# EAGLE design IFX_breakout_04_eagle7 (EAGLE 7.7.0)
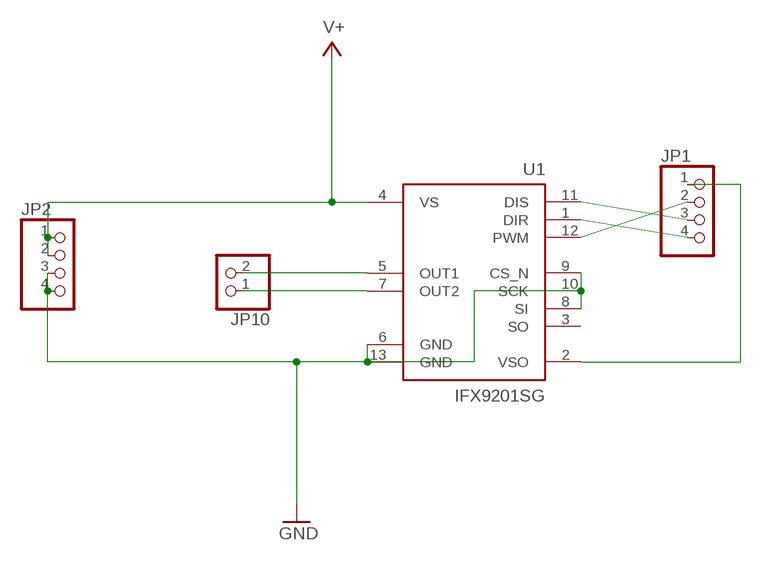
[diagram p0: schematic, sheet 1]

## Parts
JP1  PINHD-1X4  [1X04]
JP2  PINHD-1X4  [1X04]
JP10  PINHD-1X2/90  [1X02/90]
U1  IFX9201SG  [SOP100P1030X260-13N]

## Nets
!ENA: JP1.3 U1.11(DIS)
DIR: JP1.4 U1.1(DIR)
GND: JP2.3 JP2.4 U1.6(GND) U1.8(SI) U1.9(CS_N) U1.10(SCK) U1.13(GND)
N$9: JP10.2 U1.5(OUT1)
N$40: JP10.1 U1.7(OUT2)
PWM: JP1.2 U1.12(PWM)
V3.3: JP1.1 U1.2(VSO)
V+: JP2.1 JP2.2 U1.4(VS)
Unconnected: U1.3(SO)

## Library data of the parts
JP1 JP2 = pinhead:PINHD-1X4: PIN HEADER
JP10 = pinhead:PINHD-1X2: PIN HEADER
U1 = IFX9201SG:IFX9201SG: IFX9201SG 6 A H-Bridge with SPI SOP100P1030X260-13N

## Board
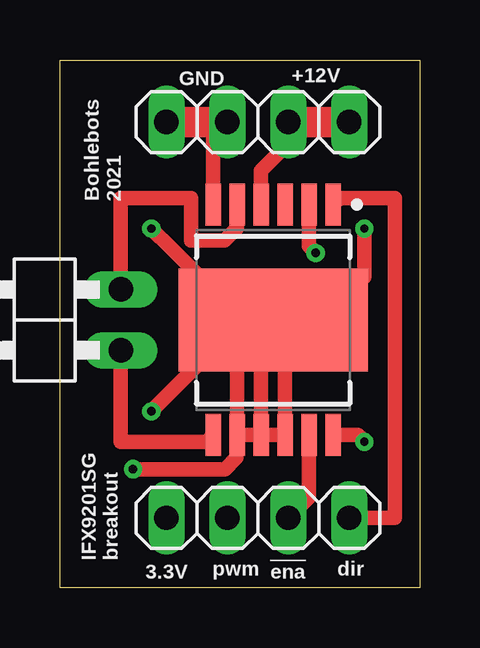
[diagram p1: board, top side]
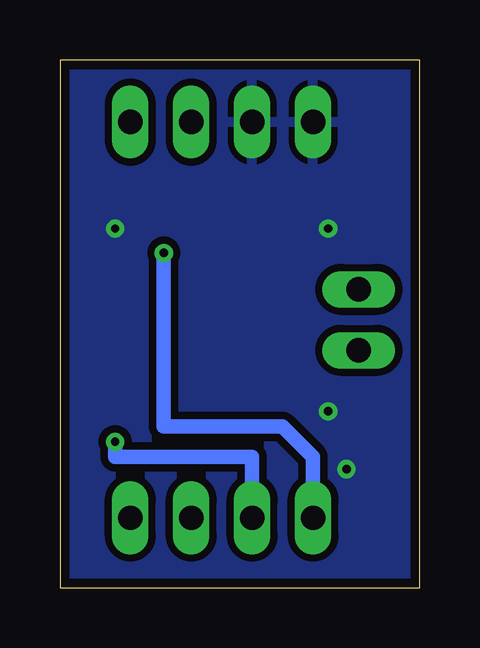
[diagram p2: board, bottom side, seen from below]

Size 15 x 22 mm. Coordinates in mm from the lower left corner, seen from the top.
Outline: 0,0 0,22 15,22 15,0 0,0
Copper layers (1*16): Top 0.035mm / dielectric 1.5mm / Bottom 0.035mm
Design rules "thomas": minimum track width 8mil, minimum drill 8mil, track to track 8mil, track to pad 8mil, pad to pad 8mil, via to via 8mil, smd to smd 8mil, copper to edge 15mil, drill to drill 8mil, minimum pad ring 10mil, minimum via ring 8mil, stop-mask expansion 0mil, vias tented up to drill 0mil, thermal gap 10mil

### Footprints (pad centres in the part's own frame; a part is rotated, then mirrored left to right if it is on the bottom)
1X04 = drill 1.016 long: 1 -3.81,0; 2 -1.27,0; 3 1.27,0; 4 3.81,0
1X02/90 = drill 1.016 long: 1 -1.27,-3.81; 2 1.27,-3.81
SOP100P1030X260-13N = smd 1.75 x 0.65: 1 -4.8,2.5; 2 -4.8,1.5; 3 -4.8,0.5; 4 -4.8,-0.5; 5 -4.8,-1.5; 6 -4.8,-2.5; 7 4.8,-2.5; 8 4.8,-1.5; 9 4.8,-0.5; 10 4.8,0.5; 11 4.8,1.5; 12 4.8,2.5 | smd 4.3 x 7.9: 13 0,0

### Placement (x,y rotation side)
JP1  8.26,2.91 0 top
JP2  8.26,19.41 180 top
JP10  -1.27,11.16 90 top
U1  8.89,11.16 270 top

### Tracks (layer width: path | path; a pad name or v marks a point on that pad's centre or on a via)
!ENA
  Top 0.61: U1.11 10.39,3.77 JP1.3
DIR
  Top 0.61: JP1.4 13.97,2.91 13.97,16.24 11.67,16.24 U1.1
GND  (via drill 0.35)
  Top 0.61: U1.6 6.39,18.74 JP2.3 | U1.13 9.27,11.16 | U1.8 7.39,10.42 8.13,11.16 U1.13 | U1.9 8.39,10.01 8.26,10.14 9.27,11.16 | 9.27,11.16 9.78,11.16 9.78,10.78 9.39,10.39 U1.10 U1.9 | 7.61,11.16 U1.13 | v3.81,7.35 7.61,11.15 7.61,11.16 | v3.81,14.97 4.65,14.13 4.65,14.12 7.61,11.16 | v12.7,14.97 12.7,12.94 12.45,12.68 | U1.9 U1.8 | U1.8 7.37,6.34 7.37,5.42 6.88,4.94 v3.05,4.94
  Top 1.27: JP2.4 JP2.3
  pour Bottom (isolate 0.305): -1.27,-1.54 -1.27,23.86 16.51,23.86 16.51,-1.54
N$9
  Top 0.61: U1.5 7.39,14.99 6.86,14.46 5.46,14.46 5.46,16.24 2.54,16.24 JP10.2
N$40
  Top 0.61: JP10.1 2.54,6.08 6.11,6.08 U1.7
PWM  (via drill 0.35)
  Top 0.61: v12.7,6.08 12.42,6.36 U1.12
  Bottom 0.61: v12.7,6.08 12.7,5.45 6.99,5.45 JP1.2
V3.3  (via drill 0.35)
  Top 0.61: v10.67,13.95 10.39,14.23 U1.2
  Bottom 0.61: JP1.1 4.45,5.45 5.71,6.71 10.67,6.71 v10.67,13.95
V+
  Top 0.61: U1.4 8.39,16.87 8.38,16.88 8.38,17.38 10.41,19.41
  Top 1.27: JP2.1 10.41,19.41 JP2.2

### Text on the board
tNames: GND | +12V | Bohlebots / 2021 | IFX9201SG / breakout | 3.3V | pwm | !ena | dir